# Altium schematic sheet [04] DOWNLOADER.SchDoc: Template
size A4; Author: Hom; CompanyName: KitSprout; DrawnBy: Hom; Engineer: Hom; Organization: KitSprout; Revision: A; SheetNumber: 4; SheetTotal: 6; Version: 0.0; LibVersion: 0.0
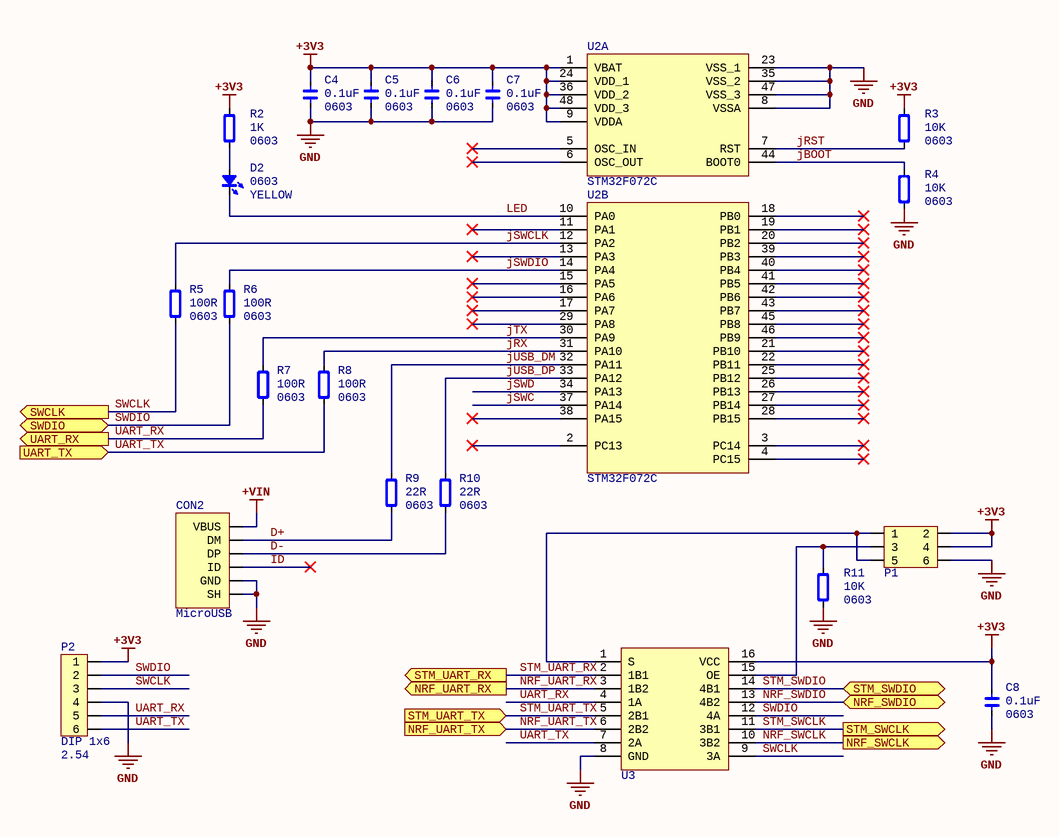
[diagram p0: [04] DOWNLOADER.SchDoc]

## Parts
C4  Type: 0603  [CAP_0603]  (hidden comment: 0.1uF)
C5  Type: 0603  [CAP_0603]  (hidden comment: 0.1uF)
C6  Type: 0603  [CAP_0603]  (hidden comment: 0.1uF)
C7  Type: 0603  [CAP_0603]  (hidden comment: 0.1uF)
C8  Type: 0603  [CAP_0603]  (hidden comment: 0.1uF)
CON2  MicroUSB  [USB_Micro-AB]
D2  Type: 0603  [LED_0603_ORANGE]  (hidden comment: YELLOW)
P1  HDR2x3_2.54  [HDR2X3_2.54_180]  (value not drawn)
P2  value 2.54  [HDR1X6_2.54_180]  (hidden comment: DIP 1x6)
R2  Type: 0603  [RES_0603]  (hidden comment: 1K)
R3  Type: 0603  [RES_0603]  (hidden comment: 10K)
R4  Type: 0603  [RES_0603]  (hidden comment: 10K)
R5  Type: 0603  [RES_0603]  (hidden comment: 100R)
R6  Type: 0603  [RES_0603]  (hidden comment: 100R)
R7  Type: 0603  [RES_0603]  (hidden comment: 100R)
R8  Type: 0603  [RES_0603]  (hidden comment: 100R)
R9  Type: 0603  [RES_0603]  (hidden comment: 22R)
R10  Type: 0603  [RES_0603]  (hidden comment: 22R)
R11  Type: 0603  [RES_0603]  (hidden comment: 10K)
U2  STM32F072C  [LQFP_P0.5_48]  (parts A,B of 2)
U3  SN74CB3Q3257  [TSSOP_E170_P0.65_16]  (value not drawn)

## Ports
NRF_SWCLK (out), NRF_SWDIO (bidir), NRF_UART_RX (out), NRF_UART_TX (in), STM_SWCLK (out), STM_SWDIO (bidir), STM_UART_RX (out), STM_UART_TX (in), SWCLK (out), SWDIO (bidir), UART_RX (out), UART_TX (in)

## Nets
+3V3: C4.2 C5.2 C6.2 C7.2 C8.2 P1.2 P1.4 P2.1 R2.2 R3.2 U2.1(VBAT) U2.9(VDDA) U2.24(VDD_1) U2.36(VDD_2) U2.48(VDD_3) U3.16(VCC)
+VIN: CON2.1(VBUS)
GND: C4.1 C5.1 C6.1 C7.1 C8.1 CON2.0(SH) CON2.5(GND) P1.6 P2.4 R4.1 R11.1 U2.8(VSSA) U2.23(VSS_1) U2.35(VSS_2) U2.47(VSS_3) U3.8(GND)
D+: CON2.2(DM) R9.1
D-: CON2.3(DP) R10.1
ID: CON2.4(ID)
jBOOT: R4.2 U2.44(BOOT0)
jRST: R3.1 U2.7(RST)
jRX: R8.1 U2.31(PA10)
jSWC: U2.37(PA14)
jSWCLK: R5.1 U2.12(PA2)
jSWD: U2.34(PA13)
jSWDIO: R6.1 U2.14(PA4)
jTX: R7.1 U2.30(PA9)
jUSB_DM: R9.2 U2.32(PA11)
jUSB_DP: R10.2 U2.33(PA12)
LED: D2.2(K) U2.10(PA0)
NRF_SWCLK: U3.10(3B2) ; port NRF_SWCLK
NRF_SWDIO: U3.13(4B2) ; port NRF_SWDIO
NRF_UART_RX: U3.3(1B2) ; port NRF_UART_RX
NRF_UART_TX: U3.6(2B2) ; port NRF_UART_TX
STM_SWCLK: U3.11(3B1) ; port STM_SWCLK
STM_SWDIO: U3.14(4B1) ; port STM_SWDIO
STM_UART_RX: U3.2(1B1) ; port STM_UART_RX
STM_UART_TX: U3.5(2B1) ; port STM_UART_TX
SWCLK: P2.3 R5.2 U3.9(3A) ; port SWCLK
SWDIO: P2.2 R6.2 U3.12(4A) ; port SWDIO
UART_RX: P2.5 R7.2 U3.4(1A) ; port UART_RX
UART_TX: P2.6 R8.2 U3.7(2A) ; port UART_TX
NetD2_1: D2.1(A) R2.1
NetP1_1: P1.1 P1.5 U3.1(S)
NetP1_3: P1.3 R11.2 U3.15(OE)

Not connected (* = marked no-connect by the designer): U2 2(PC13)* 3(PC14)* 4(PC15)* 5(OSC_IN)* 6(OSC_OUT)* 11(PA1)* 13(PA3)* 15(PA5)* 16(PA6)* 17(PA7)* 18(PB0)* 19(PB1)* 20(PB2)* 21(PB10)* 22(PB11)* 25(PB12)* 26(PB13)* 27(PB14)* 28(PB15)* 29(PA8)* 38(PA15)* 39(PB3)* 40(PB4)* 41(PB5)* 42(PB6)* 43(PB7)* 45(PB8)* 46(PB9)*

## Library data of the parts
C4-C8 = Cap_0603: Capacitor; Value: 0.1uF
CON2 = USB_Micro: USB
D2 = LED_0603: LED; Value: YELLOW
P1 = HDR2x3_2.54: Header
P2 = HDR1x6_2.54T: Header; Type: DIP 1x6
R2-R11 = Res_0603: Resistor
  R2: Value: 1K
  R3 R4 R11: Value: 10K
  R5-R8: Value: 100R
  R9 R10: Value: 22R
U2 = STM32F103C: MCU; Type: LQFP48 P0.5
U3 = SN74CB3Q3257: Switch; Type: TSSOP16 P0.65